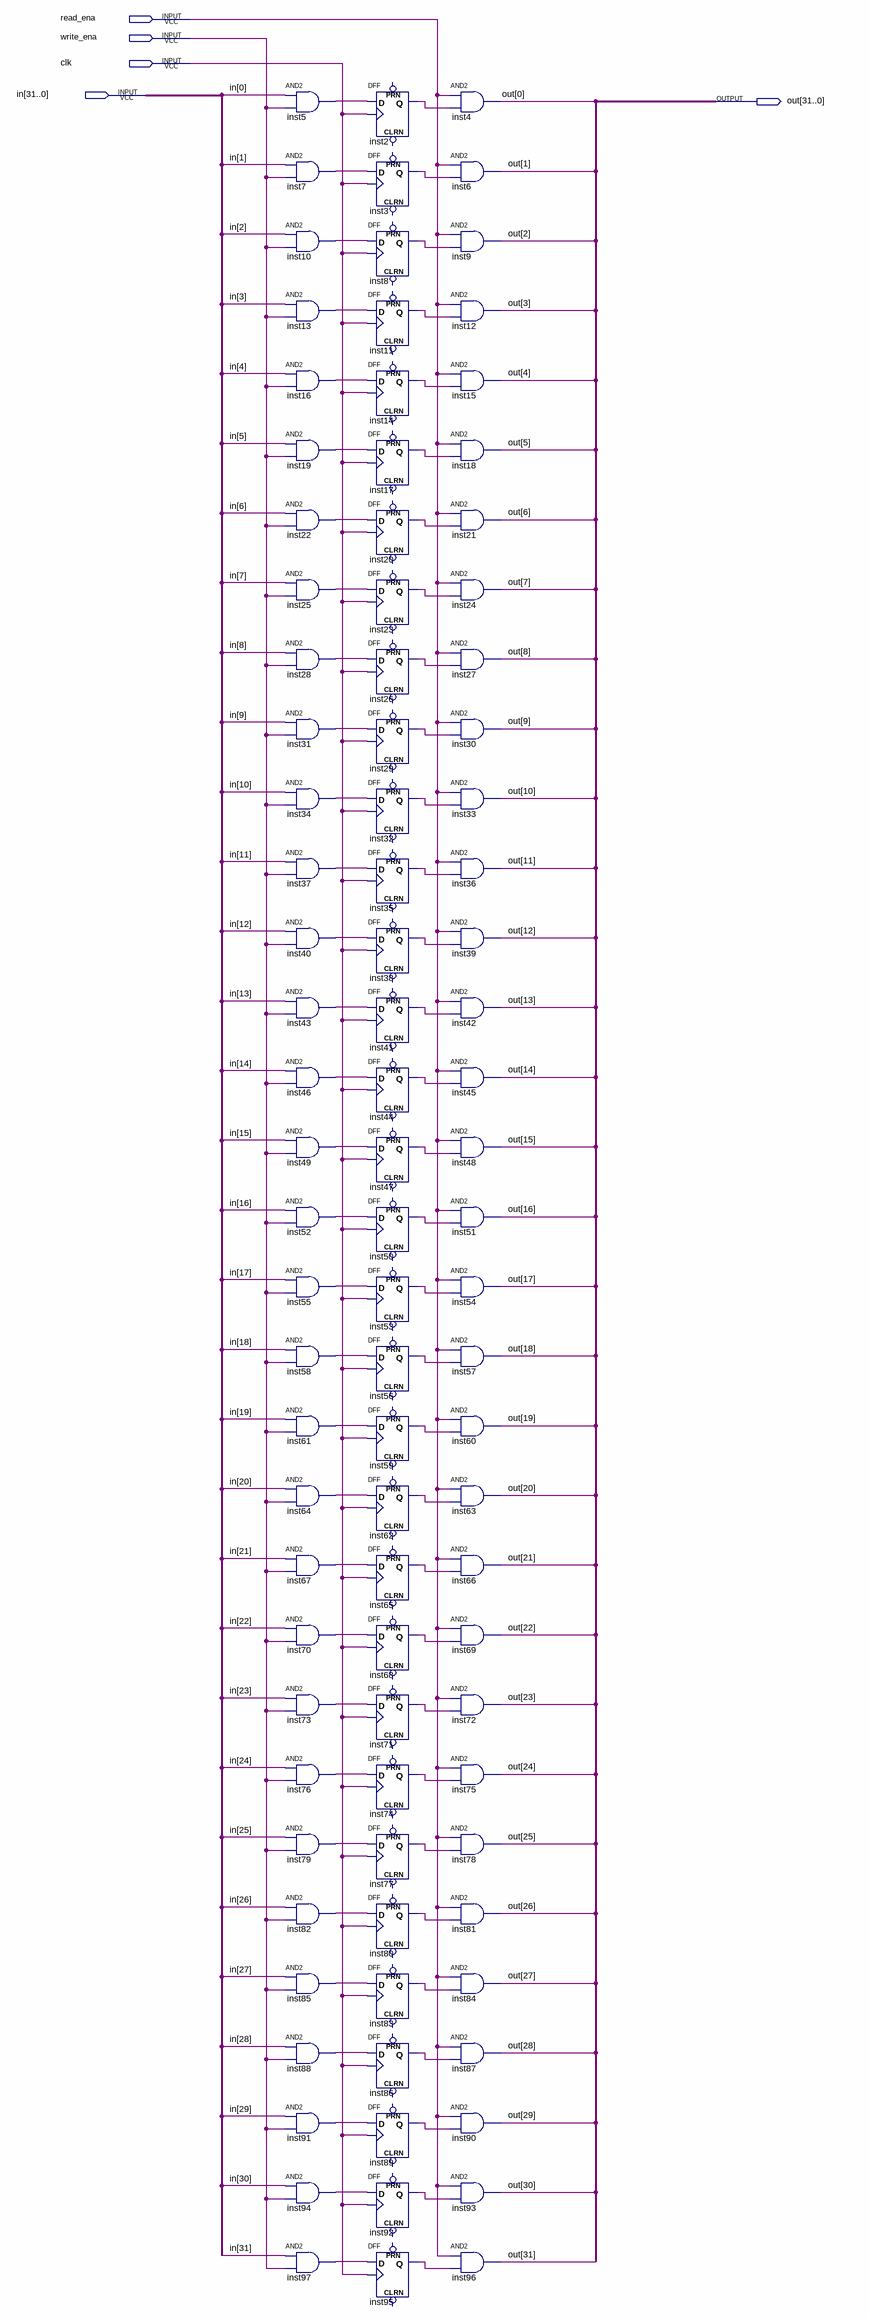
[diagram p0: schematic sheet]
// Quartus schematic register32_1.bdf as structural Verilog: 96 symbols, 5 pins
module register32_1 (
  input  read_ena,
  input  write_ena,
  input  clk,
  input  [31:0] in,
  output [31:0] out
);

  wire inst2_q, inst3_q, inst5_out, inst7_out, inst8_q, inst10_out, inst11_q, inst13_out, inst14_q,
       inst16_out, inst17_q, inst19_out, inst20_q, inst22_out, inst23_q, inst25_out, inst26_q, inst28_out,
       inst29_q, inst31_out, inst32_q, inst34_out, inst35_q, inst37_out, inst38_q, inst40_out, inst41_q,
       inst43_out, inst44_q, inst46_out, inst47_q, inst49_out, inst50_q, inst52_out, inst53_q, inst55_out,
       inst56_q, inst58_out, inst59_q, inst61_out, inst62_q, inst64_out, inst65_q, inst67_out, inst68_q,
       inst70_out, inst71_q, inst73_out, inst74_q, inst76_out, inst77_q, inst79_out, inst80_q, inst82_out,
       inst83_q, inst85_out, inst86_q, inst88_out, inst89_q, inst91_out, inst92_q, inst94_out, inst95_q,
       inst97_out;

  and inst5 (inst5_out, in[0], write_ena);
  and inst7 (inst7_out, in[1], write_ena);
  and inst10 (inst10_out, in[2], write_ena);
  and inst13 (inst13_out, in[3], write_ena);
  and inst16 (inst16_out, in[4], write_ena);
  and inst19 (inst19_out, in[5], write_ena);
  and inst22 (inst22_out, in[6], write_ena);
  and inst25 (inst25_out, in[7], write_ena);
  and inst28 (inst28_out, in[8], write_ena);
  and inst31 (inst31_out, in[9], write_ena);
  and inst34 (inst34_out, in[10], write_ena);
  and inst37 (inst37_out, in[11], write_ena);
  and inst40 (inst40_out, in[12], write_ena);
  and inst43 (inst43_out, in[13], write_ena);
  and inst46 (inst46_out, in[14], write_ena);
  and inst49 (inst49_out, in[15], write_ena);
  and inst52 (inst52_out, in[16], write_ena);
  and inst55 (inst55_out, in[17], write_ena);
  and inst58 (inst58_out, in[18], write_ena);
  and inst61 (inst61_out, in[19], write_ena);
  and inst64 (inst64_out, in[20], write_ena);
  and inst67 (inst67_out, in[21], write_ena);
  and inst70 (inst70_out, in[22], write_ena);
  and inst73 (inst73_out, in[23], write_ena);
  and inst76 (inst76_out, in[24], write_ena);
  and inst79 (inst79_out, in[25], write_ena);
  and inst82 (inst82_out, in[26], write_ena);
  and inst85 (inst85_out, in[27], write_ena);
  and inst88 (inst88_out, in[28], write_ena);
  and inst91 (inst91_out, in[29], write_ena);
  and inst94 (inst94_out, in[30], write_ena);
  and inst97 (inst97_out, in[31], write_ena);
  DFF inst2 (.CLK(clk), .D(inst5_out), .Q(inst2_q));  // open: CLRN, PRN
  DFF inst3 (.CLK(clk), .D(inst7_out), .Q(inst3_q));  // open: CLRN, PRN
  DFF inst8 (.CLK(clk), .D(inst10_out), .Q(inst8_q));  // open: CLRN, PRN
  DFF inst11 (.CLK(clk), .D(inst13_out), .Q(inst11_q));  // open: CLRN, PRN
  DFF inst14 (.CLK(clk), .D(inst16_out), .Q(inst14_q));  // open: CLRN, PRN
  DFF inst17 (.CLK(clk), .D(inst19_out), .Q(inst17_q));  // open: CLRN, PRN
  DFF inst20 (.CLK(clk), .D(inst22_out), .Q(inst20_q));  // open: CLRN, PRN
  DFF inst23 (.CLK(clk), .D(inst25_out), .Q(inst23_q));  // open: CLRN, PRN
  DFF inst26 (.CLK(clk), .D(inst28_out), .Q(inst26_q));  // open: CLRN, PRN
  DFF inst29 (.CLK(clk), .D(inst31_out), .Q(inst29_q));  // open: CLRN, PRN
  DFF inst32 (.CLK(clk), .D(inst34_out), .Q(inst32_q));  // open: CLRN, PRN
  DFF inst35 (.CLK(clk), .D(inst37_out), .Q(inst35_q));  // open: CLRN, PRN
  DFF inst38 (.CLK(clk), .D(inst40_out), .Q(inst38_q));  // open: CLRN, PRN
  DFF inst41 (.CLK(clk), .D(inst43_out), .Q(inst41_q));  // open: CLRN, PRN
  DFF inst44 (.CLK(clk), .D(inst46_out), .Q(inst44_q));  // open: CLRN, PRN
  DFF inst47 (.CLK(clk), .D(inst49_out), .Q(inst47_q));  // open: CLRN, PRN
  DFF inst50 (.CLK(clk), .D(inst52_out), .Q(inst50_q));  // open: CLRN, PRN
  DFF inst53 (.CLK(clk), .D(inst55_out), .Q(inst53_q));  // open: CLRN, PRN
  DFF inst56 (.CLK(clk), .D(inst58_out), .Q(inst56_q));  // open: CLRN, PRN
  DFF inst59 (.CLK(clk), .D(inst61_out), .Q(inst59_q));  // open: CLRN, PRN
  DFF inst62 (.CLK(clk), .D(inst64_out), .Q(inst62_q));  // open: CLRN, PRN
  DFF inst65 (.CLK(clk), .D(inst67_out), .Q(inst65_q));  // open: CLRN, PRN
  DFF inst68 (.CLK(clk), .D(inst70_out), .Q(inst68_q));  // open: CLRN, PRN
  DFF inst71 (.CLK(clk), .D(inst73_out), .Q(inst71_q));  // open: CLRN, PRN
  DFF inst74 (.CLK(clk), .D(inst76_out), .Q(inst74_q));  // open: CLRN, PRN
  DFF inst77 (.CLK(clk), .D(inst79_out), .Q(inst77_q));  // open: CLRN, PRN
  DFF inst80 (.CLK(clk), .D(inst82_out), .Q(inst80_q));  // open: CLRN, PRN
  DFF inst83 (.CLK(clk), .D(inst85_out), .Q(inst83_q));  // open: CLRN, PRN
  DFF inst86 (.CLK(clk), .D(inst88_out), .Q(inst86_q));  // open: CLRN, PRN
  DFF inst89 (.CLK(clk), .D(inst91_out), .Q(inst89_q));  // open: CLRN, PRN
  DFF inst92 (.CLK(clk), .D(inst94_out), .Q(inst92_q));  // open: CLRN, PRN
  DFF inst95 (.CLK(clk), .D(inst97_out), .Q(inst95_q));  // open: CLRN, PRN
  and inst4 (out[0], read_ena, inst2_q);
  and inst6 (out[1], read_ena, inst3_q);
  and inst9 (out[2], read_ena, inst8_q);
  and inst12 (out[3], read_ena, inst11_q);
  and inst15 (out[4], read_ena, inst14_q);
  and inst18 (out[5], read_ena, inst17_q);
  and inst21 (out[6], read_ena, inst20_q);
  and inst24 (out[7], read_ena, inst23_q);
  and inst27 (out[8], read_ena, inst26_q);
  and inst30 (out[9], read_ena, inst29_q);
  and inst33 (out[10], read_ena, inst32_q);
  and inst36 (out[11], read_ena, inst35_q);
  and inst39 (out[12], read_ena, inst38_q);
  and inst42 (out[13], read_ena, inst41_q);
  and inst45 (out[14], read_ena, inst44_q);
  and inst48 (out[15], read_ena, inst47_q);
  and inst51 (out[16], read_ena, inst50_q);
  and inst54 (out[17], read_ena, inst53_q);
  and inst57 (out[18], read_ena, inst56_q);
  and inst60 (out[19], read_ena, inst59_q);
  and inst63 (out[20], read_ena, inst62_q);
  and inst66 (out[21], read_ena, inst65_q);
  and inst69 (out[22], read_ena, inst68_q);
  and inst72 (out[23], read_ena, inst71_q);
  and inst75 (out[24], read_ena, inst74_q);
  and inst78 (out[25], read_ena, inst77_q);
  and inst81 (out[26], read_ena, inst80_q);
  and inst84 (out[27], read_ena, inst83_q);
  and inst87 (out[28], read_ena, inst86_q);
  and inst90 (out[29], read_ena, inst89_q);
  and inst93 (out[30], read_ena, inst92_q);
  and inst96 (out[31], read_ena, inst95_q);
endmodule
